# Altium schematic sheet reefvolt_power_essentials_top.SchDoc: ReefVolt Essential Power Bar: Top
size A4; DocumentNumber: 1; Revision: A; SheetNumber: 1; SheetTotal: 5; ENG_APP_DATE: --/--/--; DSN_APP_DATE: --/--/--; CHK_APP_DATE: --/--/--
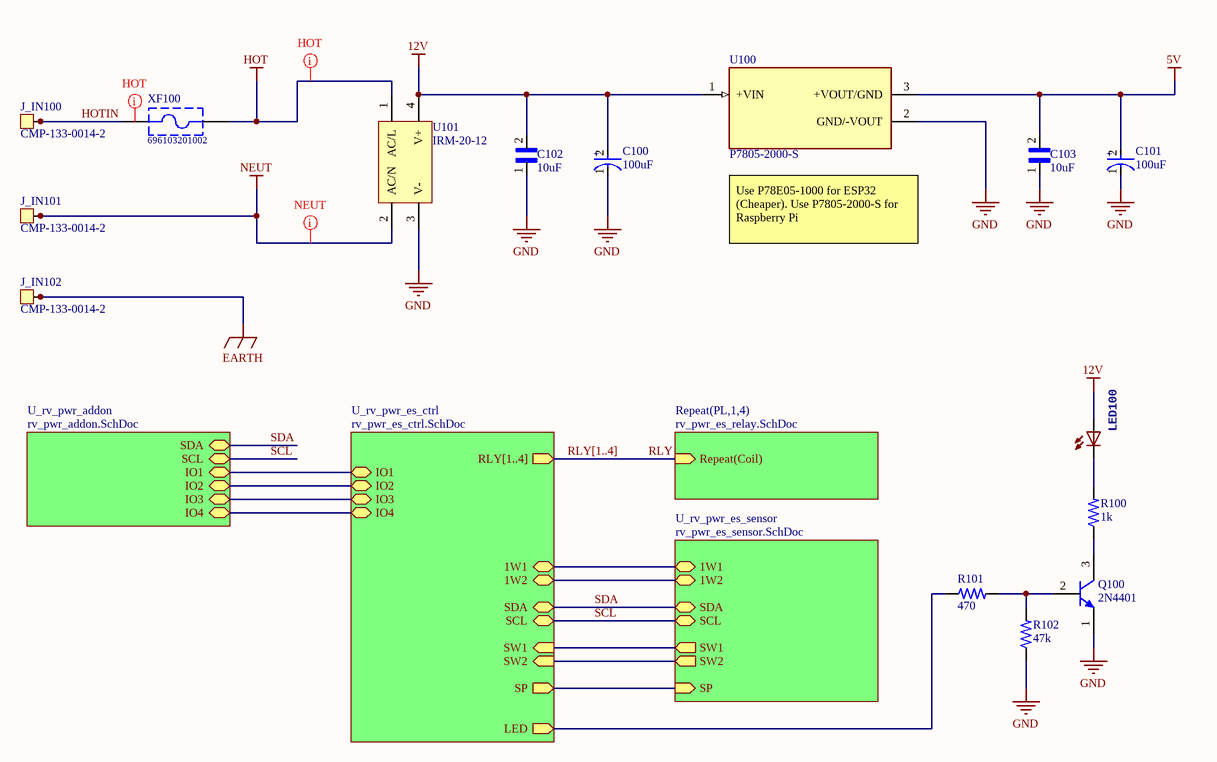
[diagram p0: reefvolt_power_essentials_top.SchDoc]

## Parts
C100  value 100uF  [FP-RAD-TH-D_8_0_5-L_11_5-MFG]  (hidden comment: CAP 100uF 25V Aluminum 8mm Through Hole)
C101  value 100uF  [FP-RAD-TH-D_8_0_5-L_11_5-MFG]  (hidden comment: CAP 100uF 25V Aluminum 8mm Through Hole)
C102  value 10uF  [CAPRB250W50L550T350H600]  (hidden comment: FG16X7R1E106KRT06)
C103  value 10uF  [CAPRB250W50L550T350H600]  (hidden comment: FG16X7R1E106KRT06)
J_IN100  CMP-133-0014-2  [0197054203]
J_IN101  CMP-133-0014-2  [0197054203]
J_IN102  CMP-133-0014-2  [0197054203]
LED100  (no value)  [LED5MM]
Q100  2N4401  [ONSC-TO-92-3-29-11]
R100  value 1k  [0207/10]  (hidden comment: 1k TH 0207 5% 0.25W)
R101  value 470  [0207/10]  (hidden comment: 470 TH 0207 5% 0.25W)
R102  value 47k  [0207/10 - Cloned]  (hidden comment: 47k TH 0207 5% 1/4W)
U100  P7805-2000-S  [CONV_P7805-2000]
U101  IRM-20-12  [MEANW-IRM-20-12]
XF100  696103201002  [696103201002]

## Sub-sheets
Repeat(PL,1,4) = rv_pwr_es_relay.SchDoc: Repeat(Coil) (in)
U_rv_pwr_addon = rv_pwr_addon.SchDoc: SDA (bidir), SCL (bidir), IO1 (bidir), IO2 (bidir), IO3 (bidir), IO4 (bidir)
U_rv_pwr_es_ctrl = rv_pwr_es_ctrl.SchDoc: RLY[1..4] (out), 1W1 (bidir), 1W2 (bidir), SCL (bidir), SDA (bidir), SW1 (in), SW2 (in), IO1 (bidir), IO2 (bidir), IO3 (bidir), IO4 (bidir), SP (out), LED (out)
U_rv_pwr_es_sensor = rv_pwr_es_sensor.SchDoc: 1W1 (bidir), 1W2 (bidir), SDA (bidir), SCL (bidir), SW1 (out), SW2 (out), SP (in)

## Nets
5V: C101.2(A) C103.2 U100.3(+VOUT/GND)
12V: C100.2(A) C102.2 LED100.A U100.1(+VIN) U101.4(V+)
EARTH: J_IN102.1 J_IN102.2 J_IN102.3
GND: C100.1(C) C101.1(C) C102.1 C103.1 Q100.1(E) R102.1 U100.2(GND/-VOUT) U101.3(V-)
HOT: U101.1(AC/L) XF100.2
NEUT: J_IN101.1 J_IN101.2 J_IN101.3 U101.2(AC/N)
HOTIN: J_IN100.1 J_IN100.2 J_IN100.3 XF100.1
RLY: sheet Repeat(PL,1,4)/Repeat(Coil)
SCL: sheet U_rv_pwr_es_ctrl/SCL, sheet U_rv_pwr_es_sensor/SCL, sheet U_rv_pwr_addon/SCL
SDA: sheet U_rv_pwr_es_ctrl/SDA, sheet U_rv_pwr_es_sensor/SDA, sheet U_rv_pwr_addon/SDA
NetLED100_K: LED100.K(C) R100.2
NetQ100_2: Q100.2(B) R101.2 R102.2
NetQ100_3: Q100.3(C) R100.1
NetR101_1: R101.1 ; sheet U_rv_pwr_es_ctrl/LED
(unnamed): sheet U_rv_pwr_es_ctrl/1W1, sheet U_rv_pwr_es_sensor/1W1
(unnamed): sheet U_rv_pwr_es_ctrl/1W2, sheet U_rv_pwr_es_sensor/1W2
(unnamed): sheet U_rv_pwr_es_ctrl/SW1, sheet U_rv_pwr_es_sensor/SW1
(unnamed): sheet U_rv_pwr_es_ctrl/SW2, sheet U_rv_pwr_es_sensor/SW2
(unnamed): sheet U_rv_pwr_es_ctrl/IO1, sheet U_rv_pwr_addon/IO1
(unnamed): sheet U_rv_pwr_es_ctrl/IO2, sheet U_rv_pwr_addon/IO2
(unnamed): sheet U_rv_pwr_es_ctrl/IO3, sheet U_rv_pwr_addon/IO3
(unnamed): sheet U_rv_pwr_es_ctrl/IO4, sheet U_rv_pwr_addon/IO4
(unnamed): sheet U_rv_pwr_es_ctrl/SP, sheet U_rv_pwr_es_sensor/SP

## Buses and harness runs
bus RLY[1..4] = sheet U_rv_pwr_es_ctrl/RLY[1..4]

## Layout directives
net class HOT: (no net found under the mark), HOT
net class NEUT: NEUT

## Notes on the sheet
- Use P78E05-1000 for ESP32 (Cheaper). Use P7805-2000-S for Raspberry Pi
- Title
- Size:
- Date:
- A4
- Number:
- Time:
- Revision:
- Sheet
- of
- github.com/blueacro
- blueacro.com
- CERN OHL v1.2
- Made available under the
- File:
- © 2021 StackFoundry LLC. All Rights Reserved.
- (in symbol CMP-001-00110-1) +

## Library data of the parts
C100 C101 = CMP-001-00110-1: Cap Aluminum 100uF 25V 20% (8 X 11.5mm) Radial 3.5mm 500mA 2000 hr 125°C Bulk; Dielectric Material: Aluminium; Diameter: 8mm; Case/Package: Radial
C102 C103 = CMP-233-000000-3: FG Series 10 uF 25 V ±10% Tolerance X7R Radial Multilayer Ceramic Capacitor; MF: TDK; Design Item ID: FG16X7R1E106KRT06; Source: FG16X7R1E106KRT06.SchLib; Component Type: Standard; Pin Count: 2; SnapEDA_Link: https://www.snapeda.com/parts/FG16X7R1E106KRT06/TDK/view-part/?ref=snap; Digi-Key_Part_Number: 445-173156-1-ND; MP: FG16X7R1E106KRT06; Purchase-URL: https://pricing.snapeda.com/search/part/FG16X7R1E106KRT06/?ref=eda; Check_prices: https://www.snapeda.com/parts/FG16X7R1E106KRT06/TDK/view-part/?ref=eda; Package: Radial TDK; Case/Package: Radial; Height - Seated (Max): 0.236inch; Lead Pitch: 0.098inch
J_IN100-J_IN102 = CMP-133-0014-2: Molex  0197054203; Source: con-molex.SCHLIB; Design Item ID: TAB_QUICKCON
LED100 = LED5MM
Q100 = CMP-013-00039-2: Transistor NPN Silicon 40V IC=600ma TO-92 Case General Purpose Amplifier And Switch; Collector Emitter Saturation Voltage: 750mV; MF: Rectron; Collector Base Voltage (VCBO): 60V; Package: TO-226-3 Rectron; Availability: In Stock; Value: *; Purchase-URL: https://pricing.snapeda.com/search/part/2N3904/?ref=eda; Case/Package: TO-92; Pin Count: 3; MP: 2N4401; Component Type: Standard; Design Item ID: 2N4401; Collector-emitter Voltage-Max: 40V; SnapEDA_Link: https://www.snapeda.com/parts/2N3904/Rectron/view-part/?ref=snap; Price: None
R100 = CMP-009-00215-2: Res Carbon Film 1K Ohm 5% 1/4W -500ppm/°C to 350ppm/°C Conformal AXL Thru-Hole Paper T/R; Diameter: 2.4mm; Contact Plating: Tin,Matte; Construction: Cylindrical; Case/Package: Conformal
R101 = CMP-009-00217-1: Res Carbon Film 470 Ohm 5% 1/4W -500ppm/°C to 350ppm/°C Conformal AXL Thru-Hole Paper T/R; Construction: Cylindrical; Diameter: 2.4mm; Case/Package: Conformal; Contact Plating: Tin,Matte
R102 = CMP-009-00220-1: Res Carbon Film 47K Ohm 5% 1/4W -500ppm/°C to 350ppm/°C Conformal AXL Thru-Hole Paper T/R; Lead Diameter: 0.55mm; Diameter: 2.4mm; Contact Plating: Tin,Matte; Case/Package: Axial
U100 = CMP-214-000001-1: Module DC-DC 24VIN 1-OUT 5V 2A 10W 3-Pin SIP Module Tube; Max Supply Voltage: 36V; Efficiency: 90%; Max Output current: 2A; Max Operating Temperature: 85°C
U101 = CMP-2000-07460-1: Single Output Encapsulated Type, 12 V, 1.8 A, 21.6 W, -40 to 85 degC, 4-Pin THD, RoHS; Manufacturer: Mean Well; Output Current: 1.8A; Output Power: 21.6W; Voltage - Output 1: 12V; Efficiency: 84%; Approvals: CB; Number of Outputs: 1; Length: 53mm; RoHSCompliant: true; Lead Free: LeadFree; Packaging: Bulk; Package Description: 4-Pin Through Hole Device, Body 52.4 x 27.2 mm, Height 24 mm; Number of Pins: 4; Mount: ThroughHole; Min Operating Temperature: -30degC; Manufacturer URL: http://www.meanwellusa.com/; Weight: 2.081164oz; Package Quantity: 240; Package Reference: IRM-20-12-4; Datasheet URL: http://datasheet.octopart.com/IRM-20-12-Mean-Well-datasheet-42021592.pdf; Max Output Power: 21.6W; Max Operating Temperature: 70degC; Height: 24mm; Mounting Technology: ThroughHole; Datasheet Version: 06/2015; Current - Output 1: 1.8A; Width: 28mm
XF100 = CMP-005-00015-1: WR-FSH Fuse Holder Blocks Fuse Holder Blocks Clip Cover for PCB - THR Version